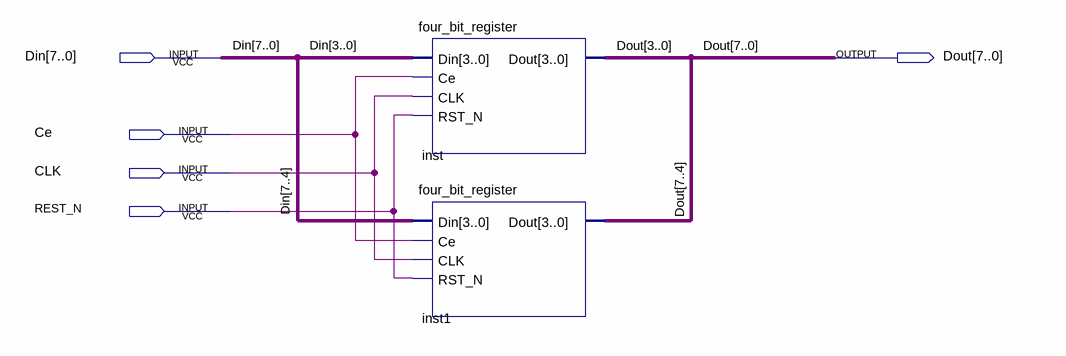
[diagram p0: schematic sheet]
// Quartus schematic eight_bit_register.bdf as structural Verilog: 2 symbols, 5 pins
module eight_bit_register (
  input  [7:0] Din,
  input  Ce,
  input  CLK,
  input  REST_N,
  output [7:0] Dout
);

  four_bit_register inst (.Din(Din[3:0]), .Ce(Ce), .CLK(CLK), .RST_N(REST_N), .Dout(Dout[3:0]));
  four_bit_register inst1 (.Din(Din[7:4]), .Ce(Ce), .CLK(CLK), .RST_N(REST_N), .Dout(Dout[7:4]));
endmodule
